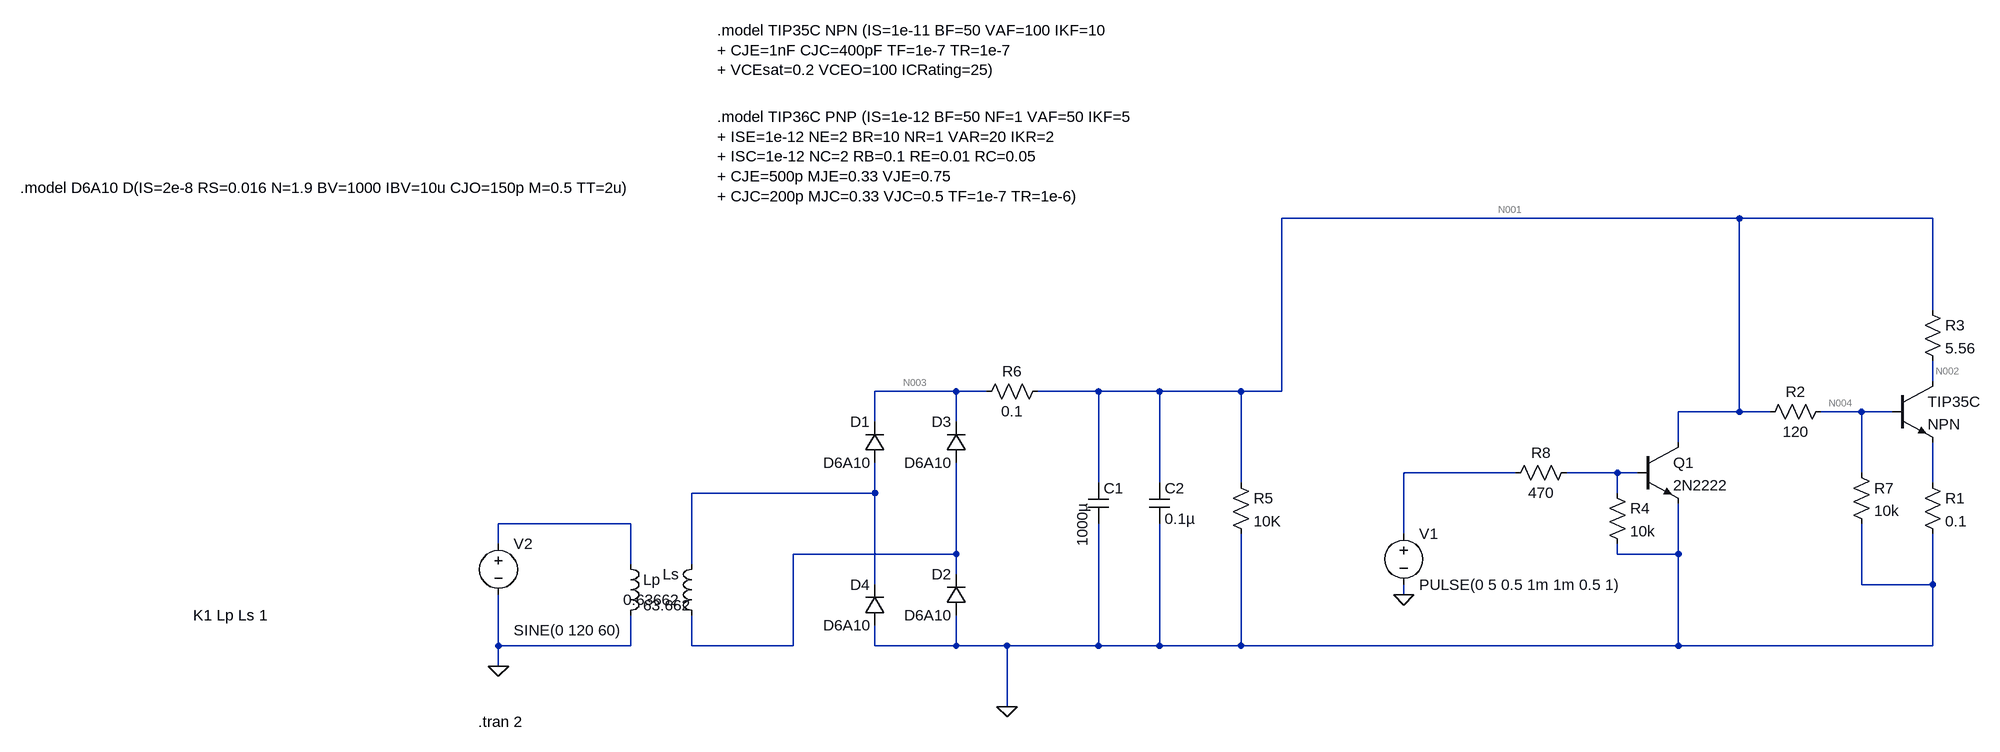
[diagram p0: schematic BJT.asc]
BJT.asc, the LTspice schematic file:
Version 4.1
SHEET 1 2020 680
WIRE 1088 -480 368 -480
WIRE 1392 -480 1088 -480
WIRE 1392 -336 1392 -480
WIRE 1392 -224 1392 -256
WIRE -144 -208 -272 -208
WIRE -96 -208 -144 -208
WIRE 80 -208 -16 -208
WIRE 176 -208 80 -208
WIRE 304 -208 176 -208
WIRE 368 -208 368 -480
WIRE 368 -208 304 -208
WIRE 1088 -176 1088 -480
WIRE 1088 -176 992 -176
WIRE 1136 -176 1088 -176
WIRE 1280 -176 1216 -176
WIRE 1328 -176 1280 -176
WIRE -272 -160 -272 -208
WIRE -144 -160 -144 -208
WIRE 992 -128 992 -176
WIRE 736 -80 560 -80
WIRE 896 -80 816 -80
WIRE 928 -80 896 -80
WIRE 1280 -80 1280 -176
WIRE 80 -64 80 -208
WIRE 176 -64 176 -208
WIRE 304 -64 304 -208
WIRE 1392 -64 1392 -128
WIRE -272 -48 -272 -96
WIRE -272 -48 -560 -48
WIRE 896 -48 896 -80
WIRE -656 0 -864 0
WIRE 560 16 560 -80
WIRE -864 32 -864 0
WIRE -144 48 -144 -96
WIRE -144 48 -400 48
WIRE 896 48 896 32
WIRE 992 48 992 -32
WIRE 992 48 896 48
WIRE -656 64 -656 0
WIRE -560 64 -560 -48
WIRE -144 80 -144 48
WIRE -272 96 -272 -48
WIRE 1280 96 1280 0
WIRE 1392 96 1392 16
WIRE 1392 96 1280 96
WIRE 560 112 560 96
WIRE -864 192 -864 112
WIRE -656 192 -656 144
WIRE -656 192 -864 192
WIRE -560 192 -560 144
WIRE -400 192 -400 48
WIRE -400 192 -560 192
WIRE -272 192 -272 160
WIRE -144 192 -144 144
WIRE -144 192 -272 192
WIRE -64 192 -144 192
WIRE 80 192 80 0
WIRE 80 192 -64 192
WIRE 176 192 176 0
WIRE 176 192 80 192
WIRE 304 192 304 16
WIRE 304 192 176 192
WIRE 992 192 992 48
WIRE 992 192 304 192
WIRE 1392 192 1392 96
WIRE 1392 192 992 192
WIRE -864 224 -864 192
WIRE -64 288 -64 192
FLAG -64 288 0
FLAG -864 224 0
FLAG 560 112 0
SYMBOL diode -256 -96 R180
WINDOW 0 24 64 Left 2
WINDOW 3 24 0 Left 2
SYMATTR InstName D1
SYMATTR Value D6A10
SYMBOL diode -128 144 R180
WINDOW 0 24 64 Left 2
WINDOW 3 24 0 Left 2
SYMATTR InstName D2
SYMATTR Value D6A10
SYMBOL diode -128 -96 R180
WINDOW 0 24 64 Left 2
WINDOW 3 24 0 Left 2
SYMATTR InstName D3
SYMATTR Value D6A10
SYMBOL diode -256 160 R180
WINDOW 0 24 64 Left 2
WINDOW 3 24 0 Left 2
SYMATTR InstName D4
SYMATTR Value D6A10
SYMBOL cap 64 -64 R0
WINDOW 3 -9 100 VLeft 2
SYMATTR Value 1000µ
SYMATTR InstName C1
SYMATTR SpiceLine V=50 Irms=1.2 Rser=0.044 Lser=13.616n
SYMBOL voltage -864 16 R0
WINDOW 3 24 152 Left 2
WINDOW 123 24 124 Left 2
WINDOW 39 0 0 Left 0
SYMATTR Value SINE(0 120 60)
SYMATTR InstName V2
SYMBOL ind -672 48 R0
SYMATTR InstName Lp
SYMATTR Value 63.662
SYMATTR Type ind
SYMATTR SpiceLine Rser=0.01
SYMBOL ind -544 160 R180
WINDOW 0 36 80 Left 2
WINDOW 3 36 40 Left 2
SYMATTR InstName Ls
SYMATTR Value 0.63662
SYMATTR Type ind
SYMBOL res 1376 -352 R0
SYMATTR InstName R3
SYMATTR Value 5.56
SYMATTR SpiceLine tol=5 pwr=25
SYMBOL voltage 560 0 R0
WINDOW 123 0 0 Left 0
WINDOW 39 0 0 Left 0
SYMATTR InstName V1
SYMATTR Value PULSE(0 5 0.5 1m 1m 0.5 1)
SYMBOL res 288 -80 R0
SYMATTR InstName R5
SYMATTR Value 10K
SYMATTR SpiceLine tol=1 pwr=0.1
SYMBOL res 0 -224 R90
WINDOW 0 0 56 VBottom 2
WINDOW 3 32 56 VTop 2
SYMATTR InstName R6
SYMATTR Value 0.1
SYMATTR SpiceLine tol=5 pwr=1
SYMBOL cap 160 -64 R0
SYMATTR InstName C2
SYMATTR Value 0.1µ
SYMATTR SpiceLine V=16 Irms=0 Rser=0 Lser=0 mfg="Murata" pn="GRM022R61C103KE01" type="X5R"
SYMBOL npn 928 -128 R0
SYMATTR InstName Q1
SYMATTR Value 2N2222
SYMBOL res 832 -96 R90
WINDOW 0 0 56 VBottom 2
WINDOW 3 32 56 VTop 2
SYMATTR InstName R8
SYMATTR Value 470
SYMATTR SpiceLine tol=1 pwr=1/4
SYMBOL npn 1328 -224 R0
SYMATTR InstName TIP35C
SYMBOL res 1376 -80 R0
SYMATTR InstName R1
SYMATTR Value 0.1
SYMATTR SpiceLine tol=5 pwr=1/4
SYMBOL res 1232 -192 R90
WINDOW 0 0 56 VBottom 2
WINDOW 3 32 56 VTop 2
SYMATTR InstName R2
SYMATTR Value 120
SYMATTR SpiceLine tol=5 pwr=2
SYMBOL res 880 -64 R0
SYMATTR InstName R4
SYMATTR Value 10k
SYMATTR SpiceLine tol=5
SYMBOL res 1264 -96 R0
SYMATTR InstName R7
SYMATTR Value 10k
TEXT -1616 -528 Left 2 !.model D6A10 D(IS=2e-8 RS=0.016 N=1.9 BV=1000 IBV=10u CJO=150p M=0.5 TT=2u)
TEXT -896 312 Left 2 !.tran 2
TEXT -1344 144 Left 2 !K1 Lp Ls 1
TEXT -520 -640 Left 2 !.model TIP36C PNP (IS=1e-12 BF=50 NF=1 VAF=50 IKF=5\n+ ISE=1e-12 NE=2 BR=10 NR=1 VAR=20 IKR=2\n+ ISC=1e-12 NC=2 RB=0.1 RE=0.01 RC=0.05\n+ CJE=500p MJE=0.33 VJE=0.75\n+ CJC=200p MJC=0.33 VJC=0.5 TF=1e-7 TR=1e-6)
TEXT -520 -776 Left 2 !.model TIP35C NPN (IS=1e-11 BF=50 VAF=100 IKF=10\n+ CJE=1nF CJC=400pF TF=1e-7 TR=1e-7\n+ VCEsat=0.2 VCEO=100 ICRating=25)

The netlist it stands for:
* BJT.asc
D1 N008 N003 D6A10
D2 0 N010 D6A10
D3 N010 N003 D6A10
D4 0 N008 D6A10
C1 N001 0 1000µ V=50 Irms=1.2 Rser=0.044 Lser=13.616n
V2 N009 0 SINE(0 120 60)
Lp N009 0 63.662 Rser=0.01
Ls N010 N008 0.63662
R3 N001 N002 5.56 tol=5 pwr=25
V1 N005 0 PULSE(0 5 0.5 1m 1m 0.5 1)
R5 N001 0 10K tol=1 pwr=0.1
R6 N001 N003 0.1 tol=5 pwr=1
C2 N001 0 0.1µ V=16 Irms=0 Rser=0 Lser=0 mfg="Murata" pn="GRM022R61C103KE01" type="X5R"
Q1 N001 N006 0 0 2N2222
R8 N006 N005 470 tol=1 pwr=1/4
Q§TIP35C N002 N004 N007 0 NPN
R1 N007 0 0.1 tol=5 pwr=1/4
R2 N004 N001 120 tol=5 pwr=2
R4 N006 0 10k tol=5
R7 N004 0 10k
.model D D
.lib standard.dio
.model NPN NPN
.model PNP PNP
.lib standard.bjt
.model D6A10 D(IS=2e-8 RS=0.016 N=1.9 BV=1000 IBV=10u CJO=150p M=0.5 TT=2u)
.tran 2
K1 Lp Ls 1
.model TIP36C PNP (IS=1e-12 BF=50 NF=1 VAF=50 IKF=5
+ ISE=1e-12 NE=2 BR=10 NR=1 VAR=20 IKR=2
+ ISC=1e-12 NC=2 RB=0.1 RE=0.01 RC=0.05
+ CJE=500p MJE=0.33 VJE=0.75
+ CJC=200p MJC=0.33 VJC=0.5 TF=1e-7 TR=1e-6)
.model TIP35C NPN (IS=1e-11 BF=50 VAF=100 IKF=10
+ CJE=1nF CJC=400pF TF=1e-7 TR=1e-7
+ VCEsat=0.2 VCEO=100 ICRating=25)
.backanno
.end

* Results of the author's LTspice run, read from the files saved beside the schematic
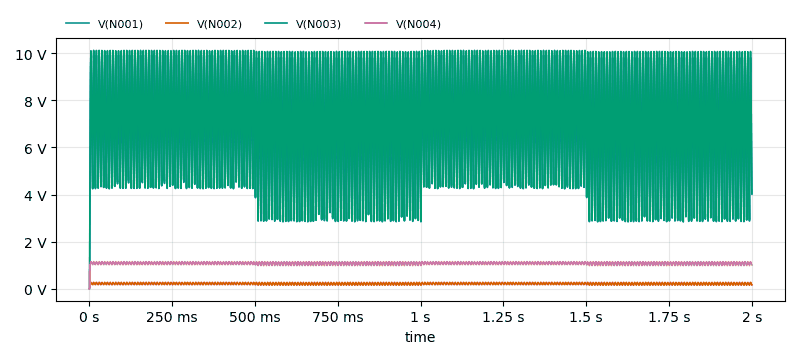
[diagram p1: Transient Analysis of BJT.asc, plotted from the saved traces]
* Transient Analysis, 1 run:
*   V(N001): min 0 V, max 9.923 V, average 6.969 V, rms 7.285 V, last 4.027 V
*   V(N002): min 0 V, max 764.8 mV, average 219.5 mV, rms 222.7 mV, last 168.1 mV
*   V(N003): min 0 V, max 10.12 V, average 7.125 V, rms 7.449 V, last 4.028 V
*   V(N004): min 0 V, max 1.15 V, average 1.084 V, rms 1.085 V, last 1.017 V